# Altium project Desafio_HW_Sillion.PrjPcb
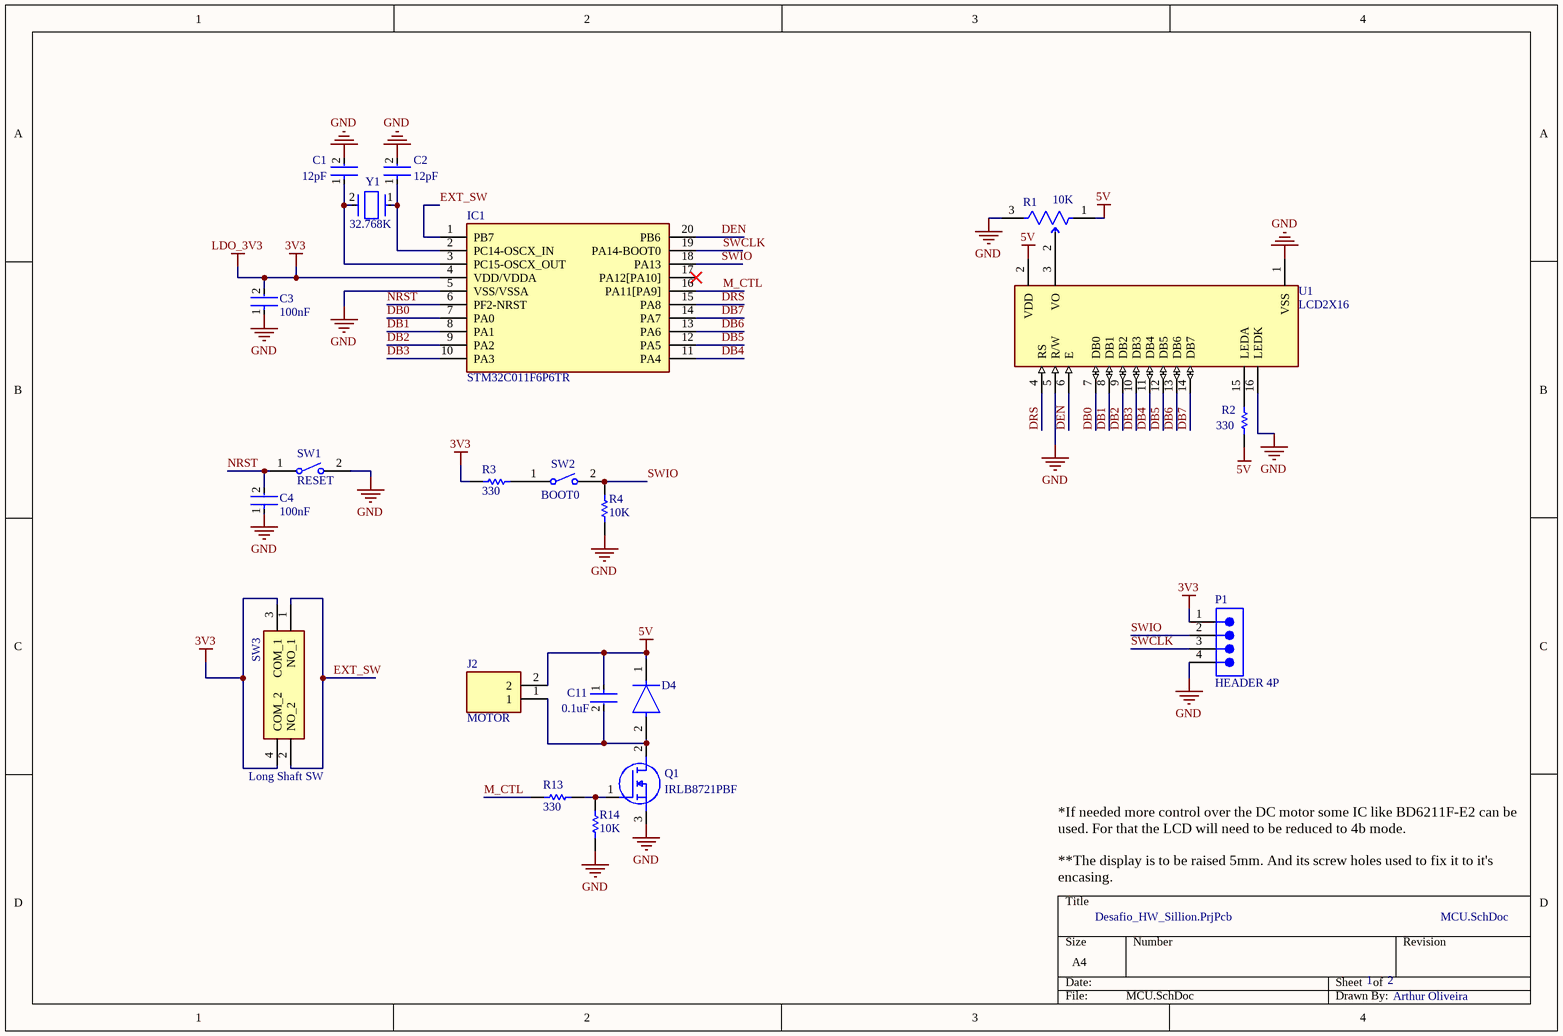
[diagram p0: MCU.SchDoc]
DesginBy: Arthur Oliveira
2 sheets, 42 parts. Net scope: global (net labels, ports and power ports of the same name join across sheets).
Board file: Desafio_HW_Sillion.PcbDoc
Sheets:
  MCU.SchDoc
  PWR.SchDoc

## Sheet MCU.SchDoc
size A4; DocumentNumber: 1; SheetNumber: 1; SheetTotal: 2

### Parts
C1  12pF  [FP-C0603C-CF-MFG]
C2  12pF  [FP-C0603C-CF-MFG]
C3  100nF  [FP-CC0805-0_85-MFG]
C4  100nF  [FP-CC0805-0_85-MFG]
C11  0.1uF  [FP-C0603-CJ-MFG]
D4  SBRT5A50SA-13  [FP-SMA-MFG]  (value not drawn)
IC1  STM32C011F6P6TR  [SOP65P640X120-20N]
J2  MOTOR  [1715022]
P1  HEADER 4P  [61300411121]
Q1  IRLB8721PBF  [TO254P483X1016X1994-3P]
R1  10K  [FP-3314J-1-MFG]
R2  330  [RESC2013X60X40LL20T25]
R3  330  [RESC2013X60X40LL20T25]
R4  10K  [RESC2013X60X40LL20T25_A]
R13  330  [RESC2013X60X40LL20T25]
R14  10K  [RESC2013X60X40LL20T25_A]
SW1  RESET  [TECO-FSMSM-2_V]
SW2  BOOT0  [TECO-FSMSM-2_V]
SW3  Long Shaft SW  [TS0266130BK160LCRD]
U1  LCD2X16  [LCD_LCD2X16]
Y1  32.768K  [FP-NX3215SA-MFG]

### Nets
3V3: C3.2 IC1.4(VDD/VDDA) P1.1 R3.2 SW3.3(COM_1) SW3.4(COM_2)  [also labelled LDO_3V3]
5V: C11.1 D4.1(C) J2.2 R1.1(CCW) R2.2 U1.2(VDD)
GND: C1.2 C2.2 C3.1 C4.1 IC1.5(VSS/VSSA) P1.4 Q1.3(S) R1.3(CW) R4.1 R14.1 SW1.2 U1.1(VSS) U1.5(R/W) U1.16(LEDK)
DB0: IC1.7(PA0) U1.7(DB0)
DB1: IC1.8(PA1) U1.8(DB1)
DB2: IC1.9(PA2) U1.9(DB2)
DB3: IC1.10(PA3) U1.10(DB3)
DB4: IC1.11(PA4) U1.11(DB4)
DB5: IC1.12(PA5) U1.12(DB5)
DB6: IC1.13(PA6) U1.13(DB6)
DB7: IC1.14(PA7) U1.14(DB7)
DEN: IC1.20(PB6) U1.6(E)
DRS: IC1.15(PA8) U1.4(RS)
EXT_SW: IC1.1(PB7) SW3.1(NO_1) SW3.2(NO_2)
M_CTL: IC1.16(PA11[PA9]) R13.2
NRST: C4.2 IC1.6(PF2-NRST) SW1.1
SWCLK: IC1.19(PA14-BOOT0) P1.3
SWIO: IC1.18(PA13) P1.2 R4.2 SW2.2
NetC1_1: C1.1 IC1.3(PC15-OSCX_OUT) Y1.2
NetC2_1: C2.1 IC1.2(PC14-OSCX_IN) Y1.1
NetC11_2: C11.2 D4.2(A) J2.1 Q1.2(D)
NetQ1_1: Q1.1(G) R13.1 R14.2
NetR1_2: R1.2(WIPER) U1.3(VO)
NetR2_1: R2.1 U1.15(LEDA)
NetR3_1: R3.1 SW2.1

Not connected (* = marked no-connect by the designer): IC1 17(PA12[PA10])*

### Notes on the sheet
- *If needed more control over the DC motor some IC like BD6211F-E2 can be used. For that the LCD will need to be reduced to 4b mode.
  **The display is to be raised 5mm. And its screw holes used to fix it to it's encasing.

### Library data of the parts
C1 C2 = CMP-2006-03703-3: Ceramic Capacitor 12Pf 50V, C0G, 5%, 0603, Full Reel; Manufacturer: KEMET; Manufacturer Part Number: C0603C120J5GACTU; Automotive Grade: Grade 1; Temperature Coefficient: 30ppm/°C; Tolerance: 0.05; Temperature Range High: +125°C; Temperature Characteristic: C0G; Temperature Range Low: -55°C; Voltage Rating: 50 V; Mouser Description: Ceramic Capacitor 12Pf 50V, C0G, 5%, 0603, Full Reel; Package: C0603C-CF; Temperature: -55°C to +125°C; Device Class L3: Ceramic Capacitors; Value: 12 pF; Material: Ceramic; Lead Free: Yes; ComponentLink2URL: https://api.kemet.com/component-edge/download/datasheet/C0603C100J5GACAUTO.pdf; Category: Cap; Capacitance: 12 pF; ComponentLink2Description: Datasheet; Device Class L1: Passive Components; Height: 0.87mm; Device Class L2: Capacitors; Digikey Description: Ceramic Capacitor 12Pf 50V, C0G, 5%, 0603, Full Reel; RoHS: TRUE; Octopart: https://octopart.com/c0603c120j5gactu-kemet-108780; Automotive: Yes
C3 C4 = CMP-1036-04402-6: CAP CER 0.1UF 16V X7R 0805; Manufacturer Part Number: CC0805KRX7R7BB104; Manufacturer: Yageo; Material: Ceramic; Tolerance: 0.1; Temperature: -30°C to +85°C; Lead Free: Yes; Footprint Url: http://www.yageo.com/exep/pages/download/literatures/UPY-C_GEN_24.pdf; Voltage Rating: 16 V; Package: CC0805-0.85; RoHS: TRUE; Digikey Description: CAP CER 0.1UF 16V X7R 0805; Category: Cap; Octopart: https://octopart.com/cc0805krx7r7bb104-yageo-39467769; Capacitance: 100 nF; Device Class L3: Ceramic Capacitors; ComponentLink2URL: http://www.yageo.com/documents/recent/UPY-GPHC_Y5V_6.3V-to-50V_8.pdf; Value: 100 nF; Temperature Range Low: -30°C; Mouser Description: Multilayer Ceramic Capacitors MLCC - SMD/SMT 100nF 16V X7R 10%; Automotive: No; Device Class L2: Capacitors; Height: 0.95mm; ComponentLink2Description: Datasheet; Temperature Characteristic: X7R; Ipc Land Pattern Name: CAPC200125X85; Device Class L1: Passive Components; Temperature Range High: +85°C
C11 = CMP-2006-03300-2: CAP CER 0.1UF 50V X7R 0603; Manufacturer Part Number: C0603X104K5RACTU; Manufacturer: Kemet; Capacitance: 100nF; Material: Ceramic; Tolerance: 10%; Value: 100nF; Temperature Coefficient: 15%; Temperature Range High: +125°C; Temperature Range Low: -55°C; Voltage: 50V; ComponentLink2Description: Datasheet; RoHS: TRUE; ComponentLink2URL: https://content.kemet.com/datasheets/KEM_C1013_X7R_FT-CAP_SMD.pdf; Device Class L3: Ceramic Capacitors; Device Class L2: Capacitors; Package: C0603-CJ; Height: 0.95mm; Device Class L1: Passive Components; Temperature Characteristic: X7R; Lead Free: Yes; Digikey Description: CAP CER 0.1UF 50V X7R 0603; Automotive: No; Mouser Description: Capacitor; Ceramic; Cap 0.1uF; Tol+10%; SMT; Flexible Termination; Vol-Rtg 50V; TR; Temperature: -55°C to +125°C; Octopart: https://octopart.com/c0603x104k5ractu-kemet-9145062; Category: Cap; Voltage Rating: 50V; Ipc Land Pattern Name: CAPC16080X80
D4 = CMP-12791-000002-1: DIODE SBR 50V 5A SMA; Manufacturer: Diodes Inc.; Max Junction Temp: +150°C; Peak Reverse Current: 30uA; Standoff Height: 0.05mm; Max Surge Forward Current: 70A; Footprint Url: https://www.diodes.com/assets/Package-Files/SMA.pdf; Digikey Description: DIODE SBR 50V 5A SMA; Temperature Range High: +150°C; Manufacturer Part Number: SBRT5A50SA-13; RoHS: TRUE; Temperature: -55°C to +150°C; Category: Diode; Package: SMA; Height: 2.4mm; Automotive: No; Max Repetitive Reverse Voltage: 50V; Forward Current: 5A; Octopart: https://octopart.com/sbrt5a50sa-13-diodes+inc.-46962091; ComponentLink2URL: https://www.diodes.com/assets/Datasheets/SBRT5A50SA.pdf; Device Class L3: Rectifier Diodes; Mouser Description: DIODE SBR 50V 5A SMA; ComponentLink2Description: Datasheet; Lead Free: Yes; Device Class L1: Discrete Semiconductors; Temperature Range Low: -55°C; Device Class L2: Diodes
IC1 = STM32C011F6P6TR: Integrated Circuit; Manufacturer_Name: STMicroelectronics; Datasheet Link: https://www.st.com/resource/en/datasheet/stm32c011d6.pdf; Height: 1.2mm; Manufacturer_Part_Number: STM32C011F6P6TR; Mouser Part Number: 511-STM32C011F6P6TR; Mouser Price/Stock: https://www.mouser.co.uk/ProductDetail/STMicroelectronics/STM32C011F6P6TR?qs=rQFj71Wb1eUlrPzOdA5ImQ%3D%3D; Arrow Part Number: STM32C011F6P6TR; Arrow Price/Stock: null?region=nac
J2 = 1715022: Connector; Manufacturer_Name: Phoenix Contact; Datasheet Link: http://www.phoenixcontact.com/de/produkte/1715022/pdf; Height: 13.85mm; Manufacturer_Part_Number: 1715022; Mouser Part Number: 651-1715022; Mouser Price/Stock: https://www.mouser.co.uk/ProductDetail/Phoenix-Contact/1715022?qs=A%2FKWGUWTCZi6QclA%252B6CJ3A%3D%3D; Arrow Part Number: 1715022; Arrow Price/Stock: null?region=nac
P1 = CMP-1502-01064-3: NexarPartId: 32855522; Operating Supply Voltage: 250V; Pitch: 2.54mm; Contact Resistance: 20mΩ; Number of Positions: 4; Current Rating: 3A; Connector Type: Male Pin; Gender: Male; Contact Plating: Gold; Height: 8.89mm; Lead Pitch: 2.54mm; Lead Free: Lead Free; Contact Mating Length: 5.9944mm; Number of Rows: 1; Termination: Solder; Packaging: Bulk; REACH SVHC: Unknown; Min Operating Temperature: -40°C; RoHS: Compliant; Number of Contacts: 4; Voltage Rating: 250V; Color: Black; Max Operating Temperature: 105°C; Contact Material: Copper; Mount: Through Hole; Orientation: Vertical; Number of Pins: 4
Q1 = IRLB8721PBF: MOSFET (N-Channel); Manufacturer_Name: Infineon; Datasheet Link: http://uk.rs-online.com/web/p/products/7259322; Height: 4.83mm; Manufacturer_Part_Number: IRLB8721PBF; Mouser Part Number: 942-IRLB8721PBF; Mouser Price/Stock: https://www.mouser.co.uk/ProductDetail/Infineon-Technologies/IRLB8721PBF?qs=9%252BKlkBgLFf0T58WYx%2FAl5A%3D%3D; Arrow Part Number: IRLB8721PBF; Arrow Price/Stock: https://www.arrow.com/en/products/irlb8721pbf/infineon-technologies-ag?region=europe
R1 = CMP-07234-000035-1: TRIMMER 10K OHM 0.25W J LEAD TOP; RoHS Compliant: Yes
R2 R3 R13 = CMP-2001-00628-1: Manufacturer: Panasonic; Part Number: ERA6AEB331V
R4 R14 = CMP-2001-00582-2: Metal Film Chip Resistor, High Reliability Type, 0.125 W, +/- 0.1%, -55 to 155 degC, 0805 (2012 Metric), RoHS, Tape and Reel; Voltage Rating: 100V; Power Rating: 125mW(1/8W); Brand: Panasonic; Temperature Coefficient: 25PPM/C; Resistance: 10kOhms; Product Category: ThinFilmResistors-SMD; Datasheet Version: 02/2016; Operating Temperature Range: -55Cto+155C; Length: 2mm; Mounting Technology: SurfaceMount; Manufacturer URL: http://www.panasonic.com/; Width: 1.25mm; Packaging: Reel; Product: ThinFilmResistorsSMD; Package / Case: 0805(2012metric); Termination Style: SMD/SMT; Tolerance: 0.1%; Datasheet URL: https://industrial.panasonic.com/cdbs/www-data/pdf/RDM0000/AOA0000C307.pdf; Package Description: 2-Pin Surface Mount Device, Body 2 x 1.25 mm; Factory Pack Quantity: 5000; Series: ERA-6A; Case Code - mm: 2012; RoHS: Details; Package Reference: 0805; Height: 0.5mm; Manufacturer: Panasonic; Case Code - in: 0805; Type: MetalFilmChipResistors
SW1 SW2 = CMP-2000-07511-1: FSMSM Push Button Switch, 50 mA, -35 to 85 degC, 2-Pin SMD, RoHS, Bulk; Manufacturer: TE Connectivity; Actuator Length: 1.07mm; Electrical Life: 20000Cycles; Actuator Material: Polyamide; Current Rating: 50mA; Illumination Type: Illuminated; Voltage Rating (DC): 24V; Contact Resistance: 100mOhm; Case\/Package: SMD/SMT; Operating Force: 180gf; Switch Travel: 0.25mm; Max Voltage Rating (DC): 12V; Throw Configuration: SPST; Packaging: LoosePiece; Max Operating Temperature: 85degC; ELV: Compliant; Package Description: 2-Pin Surface Mount Device, Body 6 x 3.5 mm, Pitch 9.19 mm; RoHSCompliant: true; Manufacturer URL: http://www.te.com/; Contact Plating: Silver; Contact Material: Brass; Mounting Technology: SurfaceMount; Contact Current Rating: 50mA; Datasheet Version: Rev. C2, 08/2014; Datasheet URL: http://www.te.com/commerce/DocumentDelivery/DDEController?Action=showdoc&DocId=Customer+Drawing%7F1437566-3%7FC2%7Fpdf%7FEnglish%7FENG_CD_1437566-3_C2_1437566_3_1_c.dwg.pdf%7F1437566-3; Mechanical Life: 20000Cycles; Package Reference: FSMSM; REACH SVHC: Unknown; Orientation: Straight; Min Operating Temperature: -35degC; Lead Free: LeadFree; Termination: GullWing; Package Quantity: 1000; Mount: SurfaceMount
SW3 = TS02-66-130-BK-160-LCR-D: Integrated Circuit; Manufacturer_Name: CUI Devices; Datasheet Link: https://www.cuidevices.com/product/resource/ts02.pdf; Height: 13.2mm; Manufacturer_Part_Number: TS02-66-130-BK-160-LCR-D; Mouser Part Number: 179-TS0266130BK160LC; Mouser Price/Stock: https://www.mouser.co.uk/ProductDetail/CUI-Devices/TS02-66-130-BK-160-LCR-D?qs=A6eO%252BMLsxmRpI4OEfaqDHA%3D%3D
U1 = LCD2X16: Display; Display: LCD 2x16 characters (blue backlight); Price: None; Value: *; MP: LCD2X16; Package: None; Availability: Unavailable
Y1 = CMP-200220-000010-1: CRYSTAL 32.7680KHZ 12.5PF SMD; Frequency Tolerance: 20ppm; ESR (Equivalent Series Resistance): 70kR; Frequency: 32.768kHz; Length: 0.126inch; Number of Pins: 2; Max Operating Temperature: 125°C; Width: 0.059inch; Load Capacitance: 12.5pF; Case/Package: SMD/SMT; Height: 0.035inch; Packaging: Tape and Reel; Mount: Surface Mount; Package Quantity: 1000; Min Operating Temperature: -40°C

## Sheet PWR.SchDoc
size A4; DocumentNumber: 2; SheetNumber: 2; SheetTotal: 2
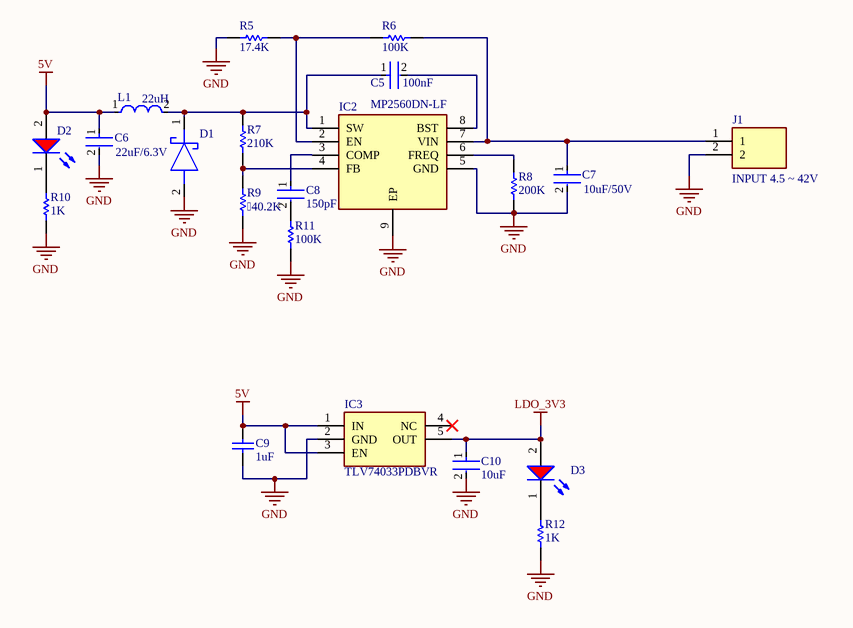
[diagram p1: PWR.SchDoc]

### Parts
C5  100nF  [FP-CC0805-0_85-MFG]
C6  22uF/6.3V  [FP-GRM21B-0_15-MFG]
C7  10uF/50V  [FP-GRM31-0_2-IPC_A]
C8  150pF  [FP-0805-L_2_01_0_2-W_1_25-IPC_A]
C9  1uF  [CAPC2013X140X50LL20T25]
C10  10uF  [FP-GRM21B-0_1-IPC_C]
D1  SBR2A40P1-7  [POWERDI123_1]  (value not drawn)
D2  RED LED  [WL-SMCW_0805_150080xx75000]  (value not drawn)
D3  RED LED  [WL-SMCW_0805_150080xx75000]  (value not drawn)
IC2  MP2560DN-LF  [SOIC127P600X170-9N]
IC3  TLV74033PDBVR  [SOT95P280X145-5N]
J1  INPUT 4.5 ~ 42V  [1715022]
L1  22uH  [FP-SRP6060FA-MFG]
R5  17.4K  [RESC2013X50X30NL20T20]
R6  100K  [RESC2013X70X40ML20T20]
R7  210K  [RESC2013X50X30LL20T20]
R8  200K  [RESC2013X50X30NL20T20]
R9  40.2K  [RESC2013X50X30NL20T20]
R10  1K  [RESC2013X50X30NL20T20]
R11  100K  [RESC2013X70X40ML20T20]
R12  1K  [RESC2013X50X30NL20T20]

### Nets
5V: C6.1 C9.2 D2.2(A) IC3.1(IN) IC3.3(EN) L1.1
GND: C6.2 C7.2 C9.1 C10.2 D1.2(A) IC2.5(GND) IC2.9(EP) IC3.2(GND) J1.2 R5.1 R8.1 R9.1 R10.1 R11.1 R12.1
LDO_3V3: C10.1 D3.2(A) IC3.5(OUT)  [project net 3V3]
NetC5_1: C5.1 D1.1(K) IC2.1(SW) L1.2 R7.2
NetC5_2: C5.2 IC2.8(BST)
NetC7_1: C7.1 IC2.7(VIN) J1.1 R6.2
NetC8_1: C8.1 IC2.3(COMP)
NetC8_2: C8.2 R11.2
NetD2_1: D2.1(K) R10.2
NetD3_1: D3.1(K) R12.2
NetIC2_2: IC2.2(EN) R5.2 R6.1
NetIC2_4: IC2.4(FB) R7.1 R9.2
NetIC2_6: IC2.6(FREQ) R8.2

Not connected (* = marked no-connect by the designer): IC3 4(NC)*

### Library data of the parts
C5 = CMP-1036-04402-6: as C3 on sheet MCU; Temperature: -30°C to +85°C; Lead Free: Yes; Footprint Url: http://www.yageo.com/exep/pages/download/literatures/UPY-C_GEN_24.pdf; Voltage Rating: 16 V; Package: CC0805-0.85; RoHS: TRUE; Digikey Description: CAP CER 0.1UF 16V X7R 0805; Category: Cap; Octopart: https://octopart.com/cc0805krx7r7bb104-yageo-39467769; Capacitance: 100 nF; Device Class L3: Ceramic Capacitors; ComponentLink2URL: http://www.yageo.com/documents/recent/UPY-GPHC_Y5V_6.3V-to-50V_8.pdf; Value: 100 nF; Temperature Range Low: -30°C; Mouser Description: Multilayer Ceramic Capacitors MLCC - SMD/SMT 100nF 16V X7R 10%; Automotive: No; Device Class L2: Capacitors; Height: 0.95mm; ComponentLink2Description: Datasheet; Temperature Characteristic: X7R; Ipc Land Pattern Name: CAPC200125X85; Device Class L1: Passive Components; Temperature Range High: +85°C
C6 = CMP-2007-03385-2: Chip Multilayer Ceramic Capacitors for General Purpose, 0805, 22uF, X5R, 15%, 20%, 6.3V; Material: Ceramic; Max Operating Temperature: 85°C; Voltage: 6.3V; Min Operating Temperature: -55°C; Case/Package: 0805; Thickness: 0.053inch; Dielectric: X5R; Packaging: Tape and Reel; Depth: 1.25mm; Termination: SMD/SMT; Voltage Rating (DC): 6.3V; Radiation Hardening: No; Tolerance: 20%; Mount: Surface Mount; Lead Free: Lead Free; Package Quantity: 1; REACH SVHC: No SVHC; Voltage Rating: 6.3V; Capacitance: 22uF; Length: 2mm; Case Code (Imperial): 0805; Case Code (Metric): 2012; Width: 0.049inch; Height: 1.25mm
C7 = CMP-2000-05256-2: CAP CER 10UF 50V X5R 1206; Manufacturer: Murata Electronics North America; Manufacturer Part Number: GRM31CR61H106KA12L; Tolerance: 10%; Temperature Coefficient: 15%; Material: Ceramic; Height: 1.8mm; Temperature: -55°C to +85°C; Lead Free: Yes; Temperature Characteristic: X5R; ComponentLink2Description: Datasheet; Digikey Description: CAP CER 10UF 50V X5R 1206; Octopart: https://octopart.com/grm31cr61h106ka12l-murata-18903335; Device Class L2: Capacitors; Automotive: No; Value: 10uF; Temperature Range High: +85°C; Temperature Range Low: -55°C; Device Class L3: Ceramic Capacitors; Voltage Rating: 50V; Capacitance: 10uF; Device Class L1: Passive Components; Mouser Description: Multilayer Ceramic Capacitors MLCC - SMD/SMT 1206 10uF 50volt X5R +/-10%; ComponentLink2URL: https://search.murata.co.jp/Ceramy/image/img/A01X/G101/ENG/GRM31CR61H106KA12-01A.pdf; Package: GRM31-0.2; RoHS: TRUE; Category: Cap
C8 = CMP-2007-04281-2: General Purpose Ceramic Capacitor, 0805, 150pF, 5%, C0G, 30ppm/°C, 50V; Lead Free: Lead Free; Tolerance: 5%; Dielectric: C0G; Packaging: Tape and Reel; RoHS Compliant: Yes; Depth: 1.25mm; Construction: Flat; Capacitance: 150pF; Max Operating Temperature: 125°C; Number of Pins: 2; Radiation Hardening: No; REACH SVHC: No SVHC; Case Code (Imperial): 0805; Series: -; Termination: SMD/SMT; Voltage: 50V; Thickness: 0.037inch; Case Code (Metric): 2012; Min Operating Temperature: -55°C; Voltage Rating (DC): 50V; Mount: Surface Mount; Length: 2.01mm; Width: 0.049inch; Package Quantity: 1; Voltage Rating: 50V; Case/Package: 0805; Contact Plating: Tin
C9 = CMP-2007-03234-1: Part Number: C0805C105K3RACTU; Manufacturer: Kemet
C10 = CMP-2007-03453-2: Chip Multilayer Ceramic Capacitors for General Purpose, 0805, 10uF, X5R, 15%, 10%, 16V; Radiation Hardening: No; Thickness: 0.053inch; Voltage Rating (DC): 16V; Lead Free: Lead Free; Package Quantity: 1; Width: 1.25mm; Case Code (Imperial): 0805; Depth: 1.25mm; Packaging: Tape and Reel; Dielectric: X5R; Max Operating Temperature: 85°C; Tolerance: 10%; Voltage Rating: 16V; Voltage: 16V; Capacitance: 10uF; Height: 1.25mm; Case Code (Metric): 2012; Material: Ceramic; Mount: Surface Mount; Case/Package: 0805; REACH SVHC: No SVHC; Length: 2mm; Min Operating Temperature: -55°C; Termination: SMD/SMT
D1 = SBR2A40P1-7: Schottky Diode; Manufacturer_Name: Diodes Incorporated; Datasheet Link: https://www.diodes.com/assets/Datasheets/SBR2A40P1.pdf; Manufacturer_Part_Number: SBR2A40P1-7; Mouser Part Number: 621-SBR2A40P1-7; Mouser Price/Stock: https://www.mouser.co.uk/ProductDetail/Diodes-Incorporated/SBR2A40P1-7?qs=KhBT%2FQof6UyH2neobXoDyQ%3D%3D; Arrow Part Number: SBR2A40P1-7; Arrow Price/Stock: https://www.arrow.com/en/products/sbr2a40p1-7/diodes-incorporated?region=nac
D2 D3 = CMP-1426-00011-2: SMD LED 0805 /; NexarPartId: 29717781; Peak Wavelength: 630nm; Wavelength: 625nm; Viewing Angle: 140°; Test Current: 20mA; Forward Voltage: 2V; Forward Current: 100mA; Lens Style: Clear, Rectangular; Luminous Intensity: 150mcd; Max Reverse Voltage (DC): 5V; Length: 2mm; Case Code (Imperial): 0805; RoHS: Compliant; Max Operating Temperature: 85°C; Height: 700µm; Packaging: Tape and Reel; Color: Red; Case/Package: 0805; REACH SVHC: Unknown; Dominant Wavelength: 625nm; Min Operating Temperature: -40°C; Case Code (Metric): 2012; Mount: Surface Mount; Width: 1.25mm
IC2 = MP2560DN-LF: Integrated Circuit; Manufacturer_Name: Monolithic Power Systems (MPS); Datasheet Link: http://www.monolithicpower.com/DesktopModules/DocumentManage/API/Document/getDocument?id=1798; Height: 1.7mm; Manufacturer_Part_Number: MP2560DN-LF; Mouser Part Number: 946-MP2560DNLF; Mouser Price/Stock: https://www.mouser.co.uk/ProductDetail/Monolithic-Power-Systems-MPS/MP2560DN-LF?qs=rC7bBWoQAAleyiym%2FnQvhQ%3D%3D
IC3 = TLV74033PDBVR: Integrated Circuit; Manufacturer_Name: Texas Instruments; Datasheet Link: https://www.ti.com/lit/ds/symlink/tlv740p.pdf?ts=1599647884466&ref_url=https%253A%252F%252Fwww.ti.com%252Fpower-management%252Flinear-regulators-ldo%252Fproducts.html; Height: 1.45mm; Manufacturer_Part_Number: TLV74033PDBVR; Mouser Part Number: 595-TLV74033PDBVR; Mouser Price/Stock: https://www.mouser.co.uk/ProductDetail/Texas-Instruments/TLV74033PDBVR?qs=sPbYRqrBIVkaG2WMvPh1eg%3D%3D; Arrow Part Number: TLV74033PDBVR; Arrow Price/Stock: null?region=nac
J1 = 1715022: as J2 on sheet MCU; Datasheet Link: http://www.phoenixcontact.com/de/produkte/1715022/pdf; Height: 13.85mm; Manufacturer_Part_Number: 1715022; Mouser Part Number: 651-1715022; Mouser Price/Stock: https://www.mouser.co.uk/ProductDetail/Phoenix-Contact/1715022?qs=A%2FKWGUWTCZi6QclA%252B6CJ3A%3D%3D; Arrow Part Number: 1715022; Arrow Price/Stock: null?region=nac
L1 = CMP-07248-000025-2: IND,6.6X6.4X5.8MM,22UH,20%,5A,SH; Self Resonant Frequency: 10MHz; Shielding: Shielded; Test Frequency: 100kHz; DC Resistance (DCR): 60.5mR; Core Material: Ferrite; Saturation Current: 5.6A; Current Rating: 5A; Composition: Wirewound; Inductance: 22uH; Min Operating Temperature: -55°C; Tolerance: 20%; Packaging: Tape and Reel; Ratings: AEC-Q200; Case/Package: Nonstandard; Mount: Surface Mount; Max Operating Temperature: 155°C
R5 = CMP-2001-04989-1: Manufacturer: Vishay Dale; Part Number: CRCW080517K4FKEA
R6 R11 = CMP-2001-04377-1: Part Number: ERJ-6ENF1003V; Manufacturer: Panasonic
R7 = CMP-1013-00770-2: Part Number: CRCW0805210KFKEA; Manufacturer: Vishay Dale
R8 = CMP-2001-03660-1: Part Number: CRCW0805200KFKEA; Manufacturer: Vishay Dale
R9 = CMP-2001-03903-1: Part Number: CRCW080540K2FKEA; Manufacturer: Vishay Dale
R10 R12 = CMP-1013-00510-2: Part Number: CRCW08051K00FKEA; Manufacturer: Vishay Dale

## Nets that join several sheets
3V3: MCU (6 pins), PWR (C10.1 D3.2 IC3.5)
5V: MCU (6 pins), PWR (6 pins)
GND: MCU (14 pins), PWR (15 pins)